# Altium project Robot.PrjPcb
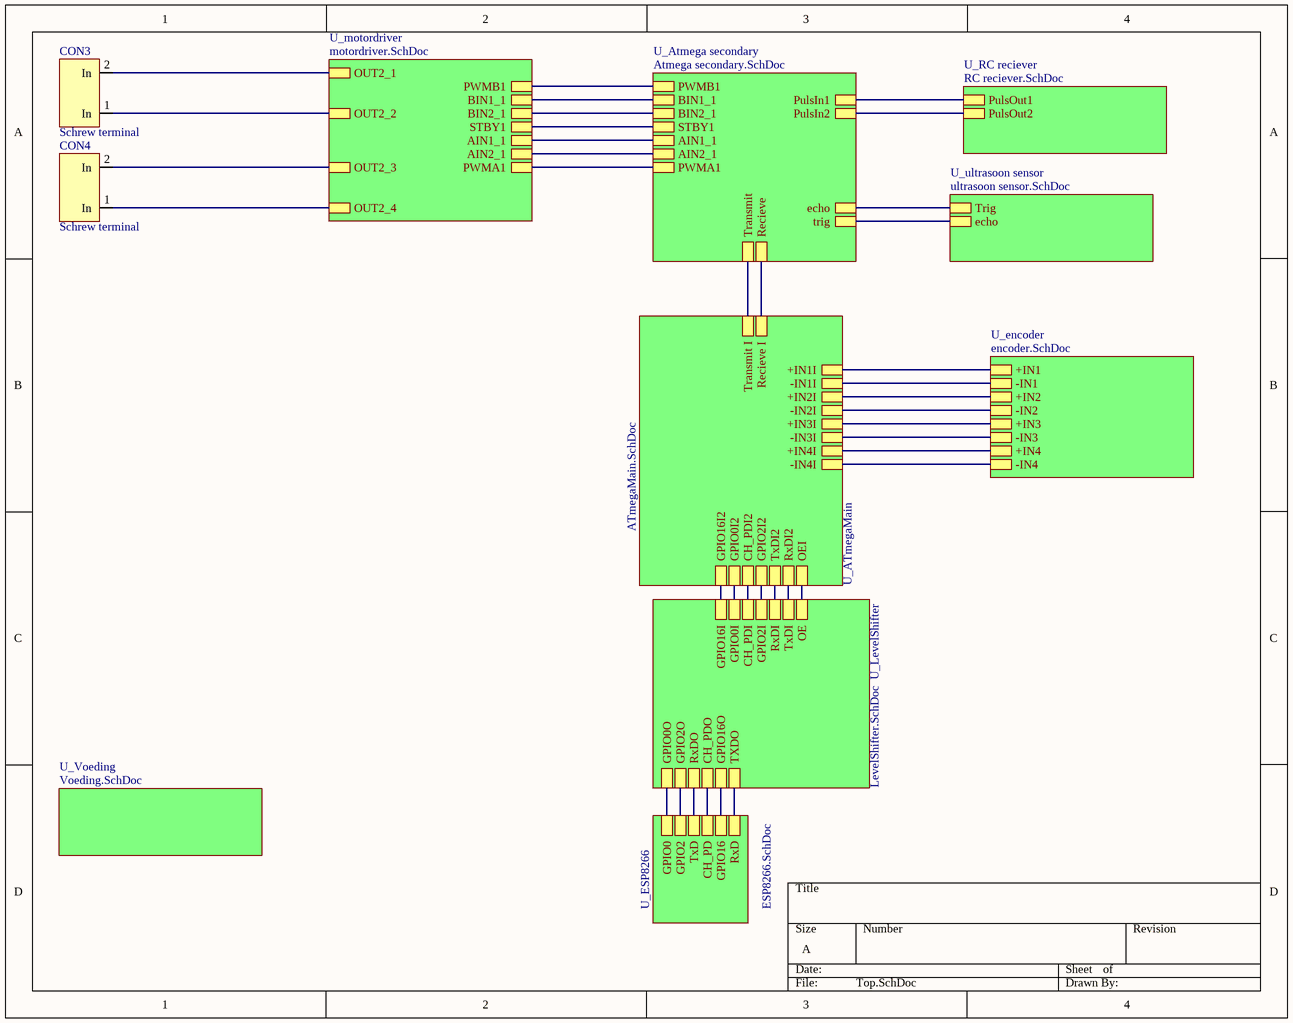
[diagram p0: Top.SchDoc]
11 sheets, 71 parts. Net scope: hierarchical (ports join the sheet entries above them; power ports are global).
Board file: ROBOTPCB.PcbDoc
Sheets:
  Top.SchDoc
    U_Voeding = Voeding.SchDoc
    U_ATmegaMain = ATmegaMain.SchDoc
    U_Atmega secondary = Atmega secondary.SchDoc
    U_encoder = encoder.SchDoc
    U_ESP8266 = ESP8266.SchDoc
    U_LevelShifter = LevelShifter.SchDoc
    U_motordriver = motordriver.SchDoc
    U_RC reciever = RC reciever.SchDoc
    U_ultrasoon sensor = ultrasoon sensor.SchDoc
  INA219 sensor.SchDoc

## Sheet Top.SchDoc
size A

### Parts
CON3  Schrew terminal  [ScrewTerminal]
CON4  Schrew terminal  [ScrewTerminal]

### Sub-sheets
U_Atmega secondary = Atmega secondary.SchDoc: PWMB1, BIN1_1, BIN2_1, STBY1, AIN1_1, AIN2_1, PWMA1, Transmit, Recieve, PulsIn1, PulsIn2, echo, trig
U_ATmegaMain = ATmegaMain.SchDoc: Recieve I, Transmit I, RxDI2, TxDI2, GPIO16I2, GPIO0I2, CH_PDI2, GPIO2I2, OEI, +IN1I, -IN1I, +IN2I, -IN2I, +IN3I, -IN3I, +IN4I, -IN4I
U_encoder = encoder.SchDoc: +IN1, -IN1, +IN2, -IN2, +IN3, -IN3, +IN4, -IN4
U_ESP8266 = ESP8266.SchDoc: RxD, GPIO16, CH_PD, TxD, GPIO2, GPIO0
U_LevelShifter = LevelShifter.SchDoc: RxDI, GPIO16I, GPIO0I, CH_PDI, GPIO2I, TxDI, RxDO, GPIO16O, GPIO0O, CH_PDO, GPIO2O, TXDO, OE
U_motordriver = motordriver.SchDoc: PWMA1, AIN2_1, AIN1_1, STBY1, BIN1_1, BIN2_1, PWMB1, OUT2_1, OUT2_2, OUT2_3, OUT2_4
U_RC reciever = RC reciever.SchDoc: PulsOut1, PulsOut2
U_ultrasoon sensor = ultrasoon sensor.SchDoc: Trig, echo
U_Voeding = Voeding.SchDoc: no entries

### Nets
NetCON3_1: CON3.1(In) ; sheet U_motordriver/OUT2_2
NetCON3_2: CON3.2(In) ; sheet U_motordriver/OUT2_1
NetCON4_1: CON4.1(In) ; sheet U_motordriver/OUT2_4
NetCON4_2: CON4.2(In) ; sheet U_motordriver/OUT2_3
NetCON5_2: sheet U_ATmegaMain/+IN1I, sheet U_encoder/+IN1
NetCON5_3: sheet U_ATmegaMain/-IN1I, sheet U_encoder/-IN1
NetCON6_2: sheet U_ATmegaMain/+IN2I, sheet U_encoder/+IN2
NetCON6_3: sheet U_ATmegaMain/-IN2I, sheet U_encoder/-IN2
NetCON7_2: sheet U_ATmegaMain/+IN3I, sheet U_encoder/+IN3
NetCON7_3: sheet U_ATmegaMain/-IN3I, sheet U_encoder/-IN3
NetCON8_2: sheet U_ATmegaMain/+IN4I, sheet U_encoder/+IN4
NetCON8_3: sheet U_ATmegaMain/-IN4I, sheet U_encoder/-IN4
NetCON11_1: sheet U_Atmega secondary/PulsIn1, sheet U_RC reciever/PulsOut1
NetCON12_1: sheet U_Atmega secondary/PulsIn2, sheet U_RC reciever/PulsOut2
NetIC1_1: sheet U_ESP8266/RxD, sheet U_LevelShifter/TXDO
NetIC1_3: sheet U_ESP8266/GPIO0, sheet U_LevelShifter/GPIO0O
NetIC1_4: sheet U_ESP8266/GPIO16, sheet U_LevelShifter/GPIO16O
NetIC1_5: sheet U_ESP8266/GPIO2, sheet U_LevelShifter/GPIO2O
NetIC1_6: sheet U_ESP8266/CH_PD, sheet U_LevelShifter/CH_PDO
NetIC1_8: sheet U_ESP8266/TxD, sheet U_LevelShifter/RxDO
NetU1_10: sheet U_ATmegaMain/OEI, sheet U_LevelShifter/OE
NetU1_13: sheet U_ATmegaMain/TxDI2, sheet U_LevelShifter/RxDI
NetU1_14: sheet U_ATmegaMain/GPIO16I2, sheet U_LevelShifter/GPIO16I
NetU1_15: sheet U_ATmegaMain/GPIO0I2, sheet U_LevelShifter/GPIO0I
NetU1_16: sheet U_ATmegaMain/CH_PDI2, sheet U_LevelShifter/CH_PDI
NetU1_17: sheet U_ATmegaMain/GPIO2I2, sheet U_LevelShifter/GPIO2I
NetU1_18: sheet U_ATmegaMain/RxDI2, sheet U_LevelShifter/TxDI
NetU2_8: sheet U_ATmegaMain/Recieve I, sheet U_Atmega secondary/Recieve
NetU2_9: sheet U_ATmegaMain/Transmit I, sheet U_Atmega secondary/Transmit
NetU5_8: sheet U_Atmega secondary/echo, sheet U_ultrasoon sensor/Trig
NetU5_9: sheet U_Atmega secondary/trig, sheet U_ultrasoon sensor/echo
NetU5_26: sheet U_Atmega secondary/PWMA1, sheet U_motordriver/PWMA1
NetU5_32: sheet U_Atmega secondary/AIN2_1, sheet U_motordriver/AIN2_1
NetU5_33: sheet U_Atmega secondary/AIN1_1, sheet U_motordriver/AIN1_1
NetU5_34: sheet U_Atmega secondary/STBY1, sheet U_motordriver/STBY1
NetU5_35: sheet U_Atmega secondary/BIN2_1, sheet U_motordriver/BIN2_1
NetU5_36: sheet U_Atmega secondary/BIN1_1, sheet U_motordriver/BIN1_1
NetU5_40: sheet U_Atmega secondary/PWMB1, sheet U_motordriver/PWMB1

## Sheet Voeding.SchDoc
size A
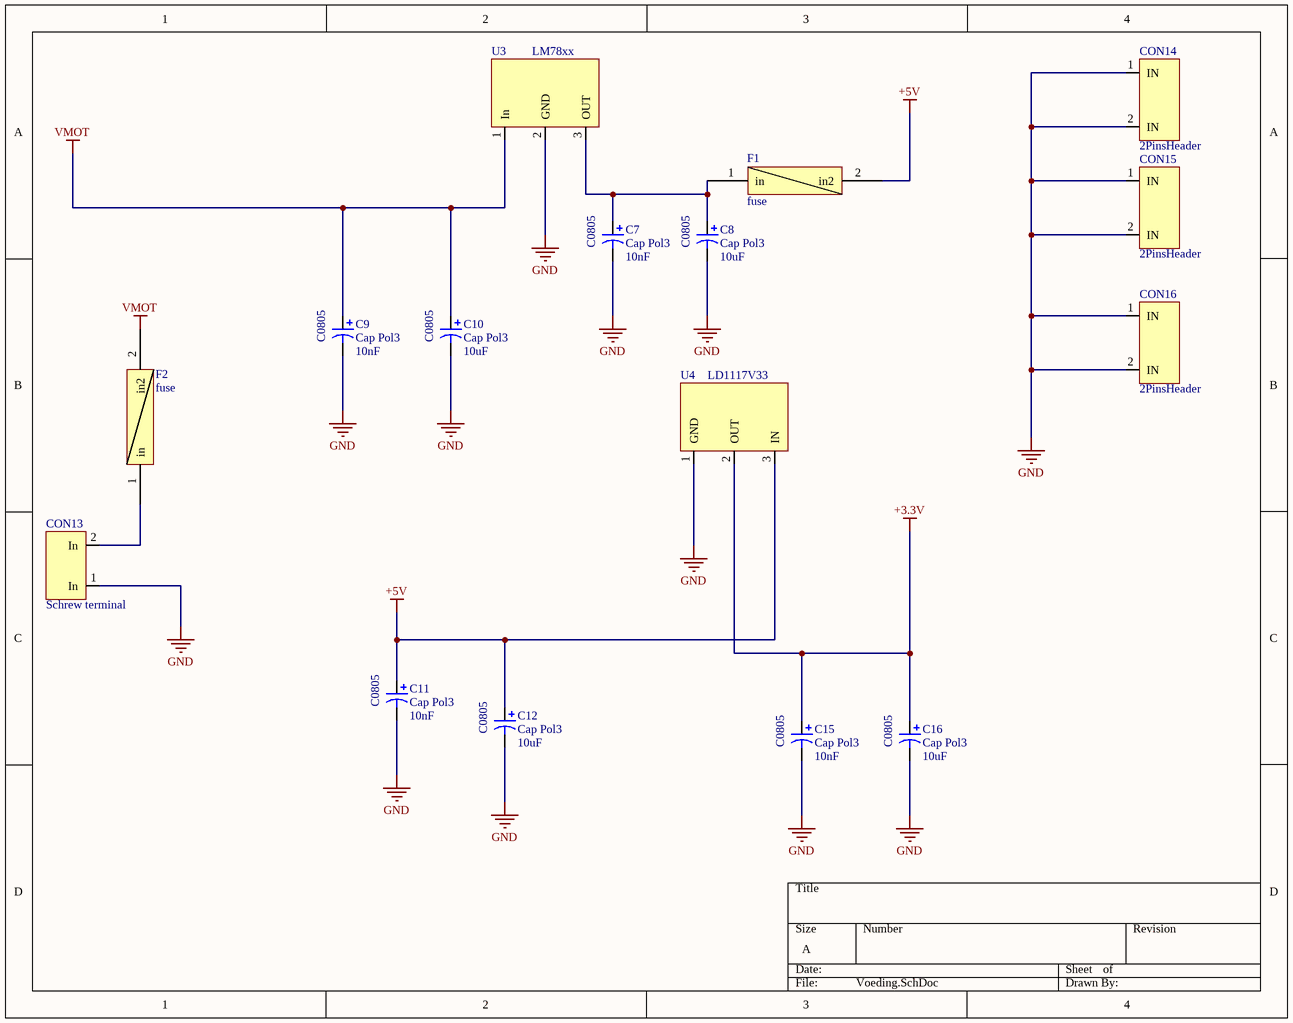
[diagram p1: Voeding.SchDoc]

### Parts
C7  Cap Pol3  value 10nF  [C0805]
C8  Cap Pol3  value 10uF  [C0805]
C9  Cap Pol3  value 10nF  [C0805]
C10  Cap Pol3  value 10uF  [C0805]
C11  Cap Pol3  value 10nF  [C0805]
C12  Cap Pol3  value 10uF  [C0805]
C15  Cap Pol3  value 10nF  [C0805]
C16  Cap Pol3  value 10uF  [C0805]
CON13  Schrew terminal  [ScrewTerminal]
CON14  2PinsHeader  [2PinsHeader]
CON15  2PinsHeader  [2PinsHeader]
CON16  2PinsHeader  [2PinsHeader]
F1  fuse  [Fuse]
F2  fuse  [Fuse]
U3  LM78xx  [LM78xx]
U4  LD1117V33  [LD117vxx]

### Nets
+3.3V: C15.1 C16.1 U4.2(OUT)
+5V: C11.1 C12.1 F1.2(in2) U4.3(IN)
GND: C7.2 C8.2 C9.2 C10.2 C11.2 C12.2 C15.2 C16.2 CON13.1(In) CON14.1(IN) CON14.2(IN) CON15.1(IN) CON15.2(IN) CON16.1(IN) CON16.2(IN) U3.2(GND) U4.1(GND)
VMOT: C9.1 C10.1 F2.2(in2) U3.1(In)
NetC7_1: C7.1 C8.1 F1.1(in) U3.3(OUT)
NetCON13_2: CON13.2(In) F2.1(in)

### Library data of the parts
C7-C12 C15 C16 = Cap Pol3: Polarized Capacitor (Surface Mount); Published: 8-Jun-2000; LatestRevisionDate: 29-May-2009; LatestRevisionNote: IPC-7351 Footprint Added.; PackageReference: C0805; Publisher: Altium Limited; PackageDescription: Chip Capacitor
F1 F2 = Component_1: fuse ptc

## Sheet ATmegaMain.SchDoc
size A
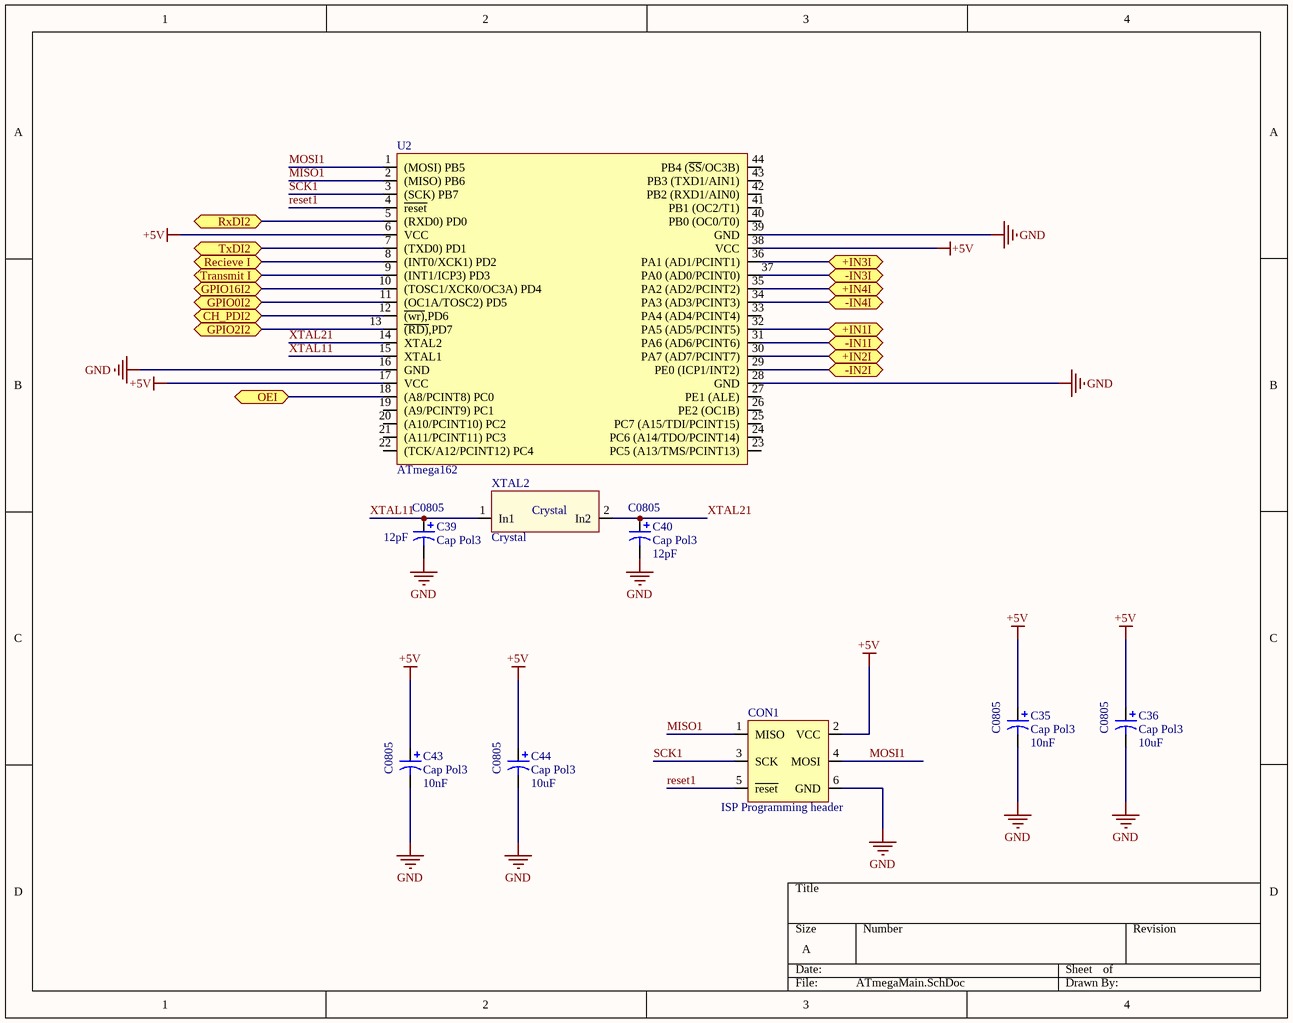
[diagram p2: ATmegaMain.SchDoc]

### Parts
C35  Cap Pol3  value 10nF  [C0805]
C36  Cap Pol3  value 10uF  [C0805]
C39  Cap Pol3  value 12pF  [C0805]
C40  Cap Pol3  value 12pF  [C0805]
C43  Cap Pol3  value 10nF  [C0805]
C44  Cap Pol3  value 10uF  [C0805]
CON1  ISP Programming header  [ISP programming header]
U2  ATmega162  [ATmga162]
XTAL2  Crystal  [Crystal]

### Ports
+IN1I, +IN2I, +IN3I, +IN4I, -IN1I, -IN2I, -IN3I, -IN4I, CH_PDI2, GPIO0I2, GPIO2I2, GPIO16I2, OEI, Recieve I, RxDI2, Transmit I, TxDI2

### Nets
+5V: C35.1 C36.1 C43.1 C44.1 CON1.2(VCC) U2.6(VCC) U2.17(VCC) U2.38(VCC)
GND: C35.2 C36.2 C39.2 C40.2 C43.2 C44.2 CON1.6(GND) U2.16(GND) U2.28(GND) U2.39(GND)
MISO1: CON1.1(MISO) U2.2((MISO)_PB6)
MOSI1: CON1.4(MOSI) U2.1((MOSI)_PB5)
reset1: CON1.5(~{reset}) U2.4(~{reset})
SCK1: CON1.3(SCK) U2.3((SCK)_PB7)
XTAL11: C39.1 U2.15(XTAL1) XTAL2.1(In1)
XTAL21: C40.1 U2.14(XTAL2) XTAL2.2(In2)
NetCON5_2: U2.32(PA5_(AD5/PCINT5)) ; port +IN1I
NetCON5_3: U2.31(PA6_(AD6/PCINT6)) ; port -IN1I
NetCON6_2: U2.30(PA7_(AD7/PCINT7)) ; port +IN2I
NetCON6_3: U2.29(PE0_(ICP1/INT2)) ; port -IN2I
NetCON7_2: U2.36(PA1_(AD1/PCINT1)) ; port +IN3I
NetCON7_3: U2.37(PA0_(AD0/PCINT0)) ; port -IN3I
NetCON8_2: U2.35(PA2_(AD2/PCINT2)) ; port +IN4I
NetCON8_3: U2.34(PA3_(AD3/PCINT3)) ; port -IN4I
NetU1_10: U2.18((A8/PCINT8)_PC0) ; port OEI
NetU1_13: U2.7((TXD0)_PD1) ; port TxDI2
NetU1_14: U2.10((TOSC1/XCK0/OC3A)_PD4) ; port GPIO16I2
NetU1_15: U2.11((OC1A/TOSC2)_PD5) ; port GPIO0I2
NetU1_16: U2.12(~{(wr}~{)},PD6) ; port CH_PDI2
NetU1_17: U2.13(~{(RD)},PD7) ; port GPIO2I2
NetU1_18: U2.5((RXD0)_PD0) ; port RxDI2
NetU2_8: U2.8((INT0/XCK1)_PD2) ; port Recieve I
NetU2_9: U2.9((INT1/ICP3)_PD3) ; port Transmit I

Not connected (* = marked no-connect by the designer): U2 19((A9/PCINT9)_PC1) 20((A10/PCINT10)_PC2) 21((A11/PCINT11)_PC3) 22((TCK/A12/PCINT12)_PC4) 23(PC5_(A13/TMS/PCINT13)) 24(PC6_(A14/TDO/PCINT14)) 25(PC7_(A15/TDI/PCINT15)) 26(PE2_(OC1B)) 27(PE1_(ALE)) 33(PA4_(AD4/PCINT4)) 40(PB0_(OC0/T0)) 41(PB1_(OC2/T1)) 42(PB2_(RXD1/AIN0)) 43(PB3_(TXD1/AIN1)) 44(PB4_(~{SS}/OC3B))

### Library data of the parts
C35 C36 C39 C40 C43 C44 = Cap Pol3: Polarized Capacitor (Surface Mount); Published: 8-Jun-2000; LatestRevisionDate: 29-May-2009; LatestRevisionNote: IPC-7351 Footprint Added.; PackageReference: C0805; Publisher: Altium Limited; PackageDescription: Chip Capacitor

## Sheet Atmega secondary.SchDoc
size A
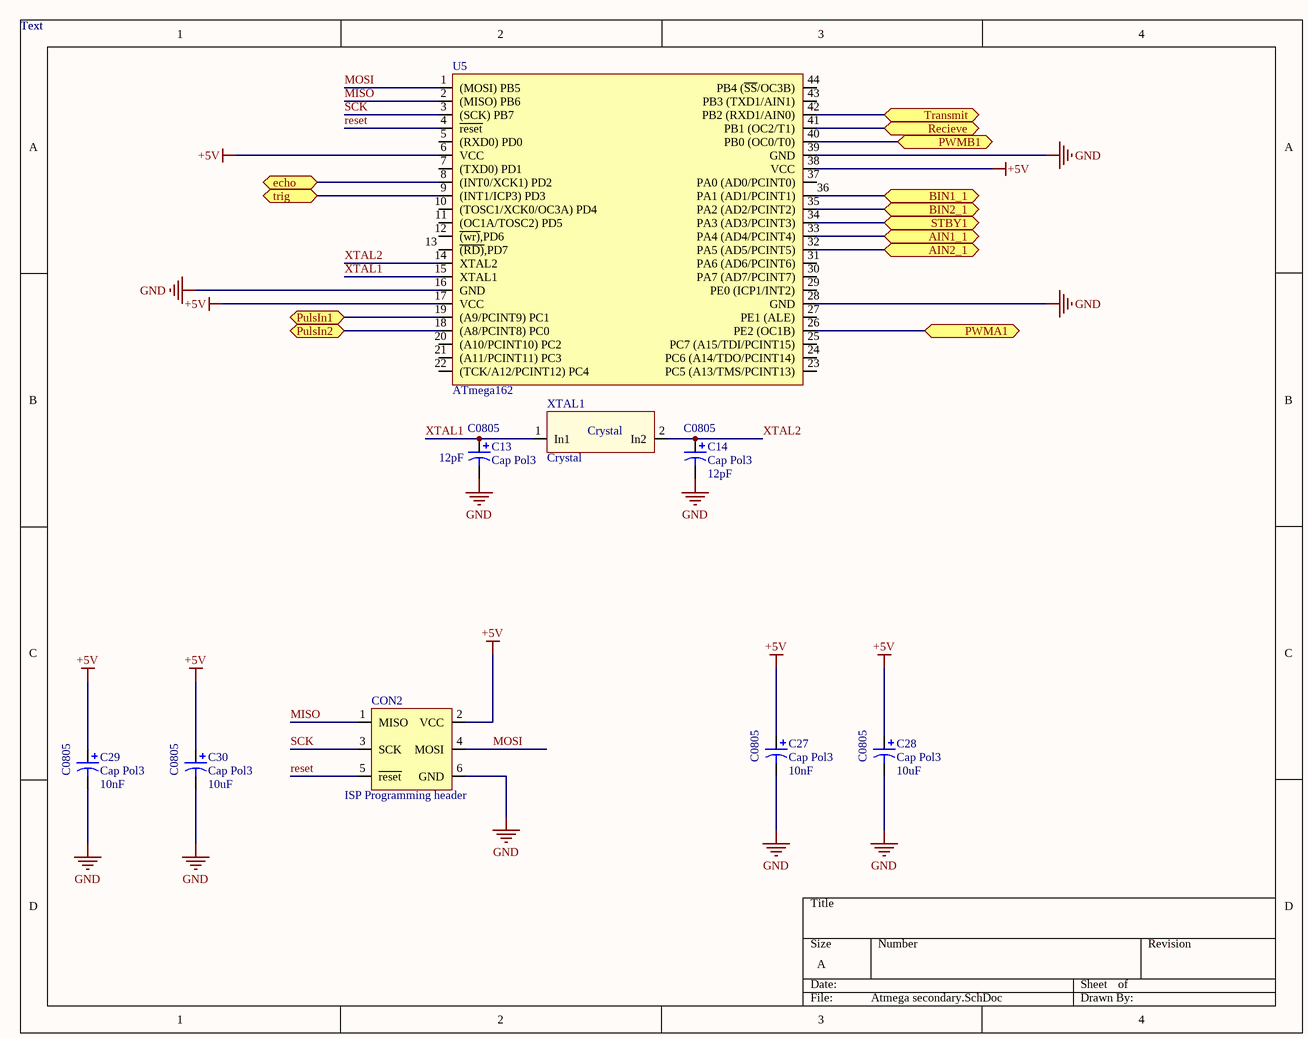
[diagram p3: Atmega secondary.SchDoc]

### Parts
C13  Cap Pol3  value 12pF  [C0805]
C14  Cap Pol3  value 12pF  [C0805]
C27  Cap Pol3  value 10nF  [C0805]
C28  Cap Pol3  value 10uF  [C0805]
C29  Cap Pol3  value 10nF  [C0805]
C30  Cap Pol3  value 10uF  [C0805]
CON2  ISP Programming header  [ISP programming header]
U5  ATmega162  [ATmga162]
XTAL1  Crystal  [Crystal]

### Ports
AIN1_1, AIN2_1, BIN1_1, BIN2_1, echo, PulsIn1, PulsIn2, PWMA1, PWMB1, Recieve, STBY1, Transmit, trig

### Nets
+5V: C27.1 C28.1 C29.1 C30.1 CON2.2(VCC) U5.6(VCC) U5.17(VCC) U5.38(VCC)
GND: C13.2 C14.2 C27.2 C28.2 C29.2 C30.2 CON2.6(GND) U5.16(GND) U5.28(GND) U5.39(GND)
MISO: CON2.1(MISO) U5.2((MISO)_PB6)
MOSI: CON2.4(MOSI) U5.1((MOSI)_PB5)
reset: CON2.5(~{reset}) U5.4(~{reset})
SCK: CON2.3(SCK) U5.3((SCK)_PB7)
XTAL1: C13.1 U5.15(XTAL1) XTAL1.1(In1)
XTAL2: C14.1 U5.14(XTAL2) XTAL1.2(In2)
NetCON11_1: U5.19((A9/PCINT9)_PC1) ; port PulsIn1
NetCON12_1: U5.18((A8/PCINT8)_PC0) ; port PulsIn2
NetU2_8: U5.41(PB1_(OC2/T1)) ; port Recieve
NetU2_9: U5.42(PB2_(RXD1/AIN0)) ; port Transmit
NetU5_8: U5.8((INT0/XCK1)_PD2) ; port echo
NetU5_9: U5.9((INT1/ICP3)_PD3) ; port trig
NetU5_26: U5.26(PE2_(OC1B)) ; port PWMA1
NetU5_32: U5.32(PA5_(AD5/PCINT5)) ; port AIN2_1
NetU5_33: U5.33(PA4_(AD4/PCINT4)) ; port AIN1_1
NetU5_34: U5.34(PA3_(AD3/PCINT3)) ; port STBY1
NetU5_35: U5.35(PA2_(AD2/PCINT2)) ; port BIN2_1
NetU5_36: U5.36(PA1_(AD1/PCINT1)) ; port BIN1_1
NetU5_40: U5.40(PB0_(OC0/T0)) ; port PWMB1

Not connected (* = marked no-connect by the designer): U5 5((RXD0)_PD0) 7((TXD0)_PD1) 10((TOSC1/XCK0/OC3A)_PD4) 11((OC1A/TOSC2)_PD5) 12(~{(wr}~{)},PD6) 13(~{(RD)},PD7) 20((A10/PCINT10)_PC2) 21((A11/PCINT11)_PC3) 22((TCK/A12/PCINT12)_PC4) 23(PC5_(A13/TMS/PCINT13)) 24(PC6_(A14/TDO/PCINT14)) 25(PC7_(A15/TDI/PCINT15)) 27(PE1_(ALE)) 29(PE0_(ICP1/INT2)) 30(PA7_(AD7/PCINT7)) 31(PA6_(AD6/PCINT6)) 37(PA0_(AD0/PCINT0)) 43(PB3_(TXD1/AIN1)) 44(PB4_(~{SS}/OC3B))

### Notes on the sheet
- Text

### Library data of the parts
C13 C14 C27-C30 = Cap Pol3: Polarized Capacitor (Surface Mount); Published: 8-Jun-2000; LatestRevisionDate: 29-May-2009; LatestRevisionNote: IPC-7351 Footprint Added.; PackageReference: C0805; Publisher: Altium Limited; PackageDescription: Chip Capacitor

## Sheet encoder.SchDoc
size A
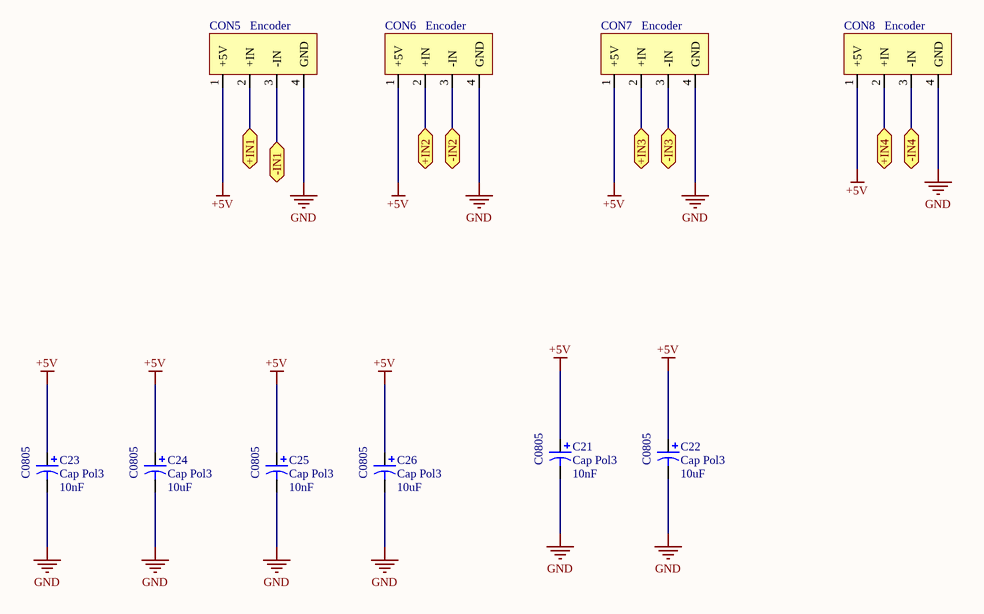
[diagram p4: encoder.SchDoc]

### Parts
C21  Cap Pol3  value 10nF  [C0805]
C22  Cap Pol3  value 10uF  [C0805]
C23  Cap Pol3  value 10nF  [C0805]
C24  Cap Pol3  value 10uF  [C0805]
C25  Cap Pol3  value 10nF  [C0805]
C26  Cap Pol3  value 10uF  [C0805]
CON5  Encoder  [ENCODER]
CON6  Encoder  [ENCODER]
CON7  Encoder  [ENCODER]
CON8  Encoder  [ENCODER]

### Ports
+IN1, +IN2, +IN3, +IN4, -IN1, -IN2, -IN3, -IN4

### Nets
+5V: C21.1 C22.1 C23.1 C24.1 C25.1 C26.1 CON5.1(+5V) CON6.1(+5V) CON7.1(+5V) CON8.1(+5V)
GND: C21.2 C22.2 C23.2 C24.2 C25.2 C26.2 CON5.4(GND) CON6.4(GND) CON7.4(GND) CON8.4(GND)
NetCON5_2: CON5.2(+IN) ; port +IN1
NetCON5_3: CON5.3(-IN) ; port -IN1
NetCON6_2: CON6.2(+IN) ; port +IN2
NetCON6_3: CON6.3(-IN) ; port -IN2
NetCON7_2: CON7.2(+IN) ; port +IN3
NetCON7_3: CON7.3(-IN) ; port -IN3
NetCON8_2: CON8.2(+IN) ; port +IN4
NetCON8_3: CON8.3(-IN) ; port -IN4

### Library data of the parts
C21-C26 = Cap Pol3: Polarized Capacitor (Surface Mount); Published: 8-Jun-2000; LatestRevisionDate: 29-May-2009; LatestRevisionNote: IPC-7351 Footprint Added.; PackageReference: C0805; Publisher: Altium Limited; PackageDescription: Chip Capacitor

## Sheet ESP8266.SchDoc
size A
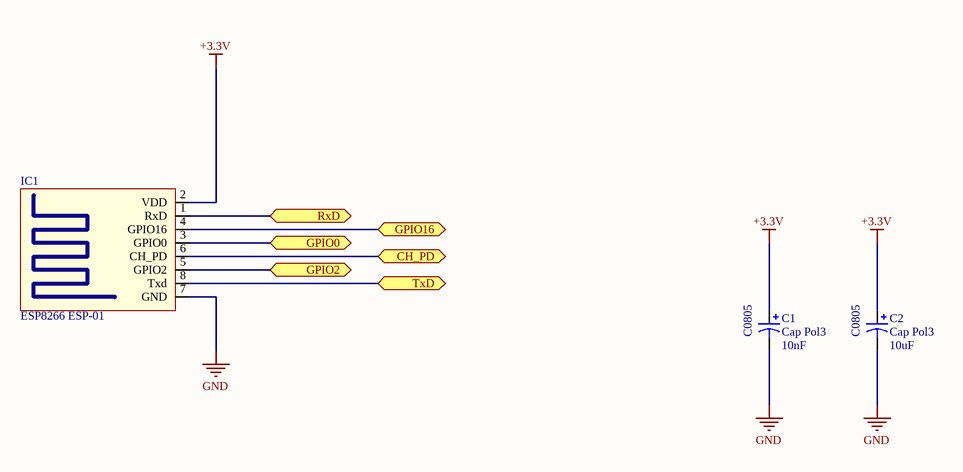
[diagram p5: ESP8266.SchDoc]

### Parts
C1  Cap Pol3  value 10nF  [C0805]
C2  Cap Pol3  value 10uF  [C0805]
IC1  ESP8266 ESP-01  [ESP8266 ESP-01]

### Ports
CH_PD, GPIO0, GPIO2, GPIO16, RxD, TxD

### Nets
+3.3V: C1.1 C2.1 IC1.2(VDD)
GND: C1.2 C2.2 IC1.7(GND)
NetIC1_1: IC1.1(RxD) ; port RxD
NetIC1_3: IC1.3(GPIO0) ; port GPIO0
NetIC1_4: IC1.4(GPIO16) ; port GPIO16
NetIC1_5: IC1.5(GPIO2) ; port GPIO2
NetIC1_6: IC1.6(CH_PD) ; port CH_PD
NetIC1_8: IC1.8(Txd) ; port TxD

### Library data of the parts
C1 C2 = Cap Pol3: Polarized Capacitor (Surface Mount); Published: 8-Jun-2000; LatestRevisionDate: 29-May-2009; LatestRevisionNote: IPC-7351 Footprint Added.; PackageReference: C0805; Publisher: Altium Limited; PackageDescription: Chip Capacitor

## Sheet LevelShifter.SchDoc
size A
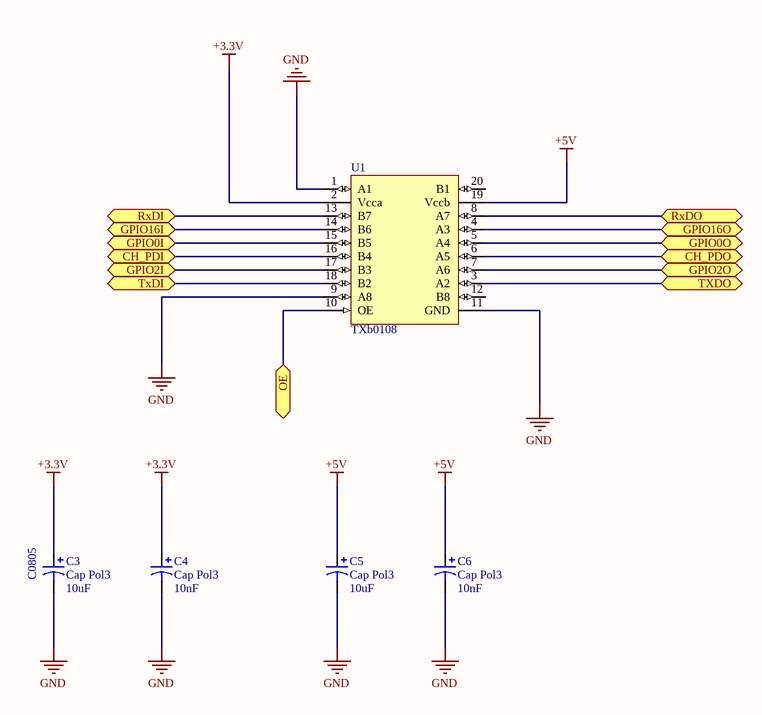
[diagram p6: LevelShifter.SchDoc]

### Parts
C3  Cap Pol3  value 10uF  [C0805]
C4  Cap Pol3  value 10nF  [C0805]
C5  Cap Pol3  value 10uF  [C0805]
C6  Cap Pol3  value 10nF  [C0805]
U1  TXb0108  [TXB0108]

### Ports
CH_PDI, CH_PDO, GPIO0I, GPIO0O, GPIO2I, GPIO2O, GPIO16I, GPIO16O, OE, RxDI, RxDO, TxDI, TXDO

### Nets
+3.3V: C3.1 C4.1 U1.2(Vcca)
+5V: C5.1 C6.1 U1.19(Vccb)
GND: C3.2 C4.2 C5.2 C6.2 U1.1(A1) U1.9(A8) U1.11(GND)
NetIC1_1: U1.3(A2) ; port TXDO
NetIC1_3: U1.5(A4) ; port GPIO0O
NetIC1_4: U1.4(A3) ; port GPIO16O
NetIC1_5: U1.7(A6) ; port GPIO2O
NetIC1_6: U1.6(A5) ; port CH_PDO
NetIC1_8: U1.8(A7) ; port RxDO
NetU1_10: U1.10(OE) ; port OE
NetU1_13: U1.13(B7) ; port RxDI
NetU1_14: U1.14(B6) ; port GPIO16I
NetU1_15: U1.15(B5) ; port GPIO0I
NetU1_16: U1.16(B4) ; port CH_PDI
NetU1_17: U1.17(B3) ; port GPIO2I
NetU1_18: U1.18(B2) ; port TxDI

Not connected (* = marked no-connect by the designer): U1 12(B8) 20(B1)

### Library data of the parts
C3-C6 = Cap Pol3: Polarized Capacitor (Surface Mount); Published: 8-Jun-2000; LatestRevisionDate: 29-May-2009; LatestRevisionNote: IPC-7351 Footprint Added.; PackageReference: C0805; Publisher: Altium Limited; PackageDescription: Chip Capacitor

## Sheet motordriver.SchDoc
size A
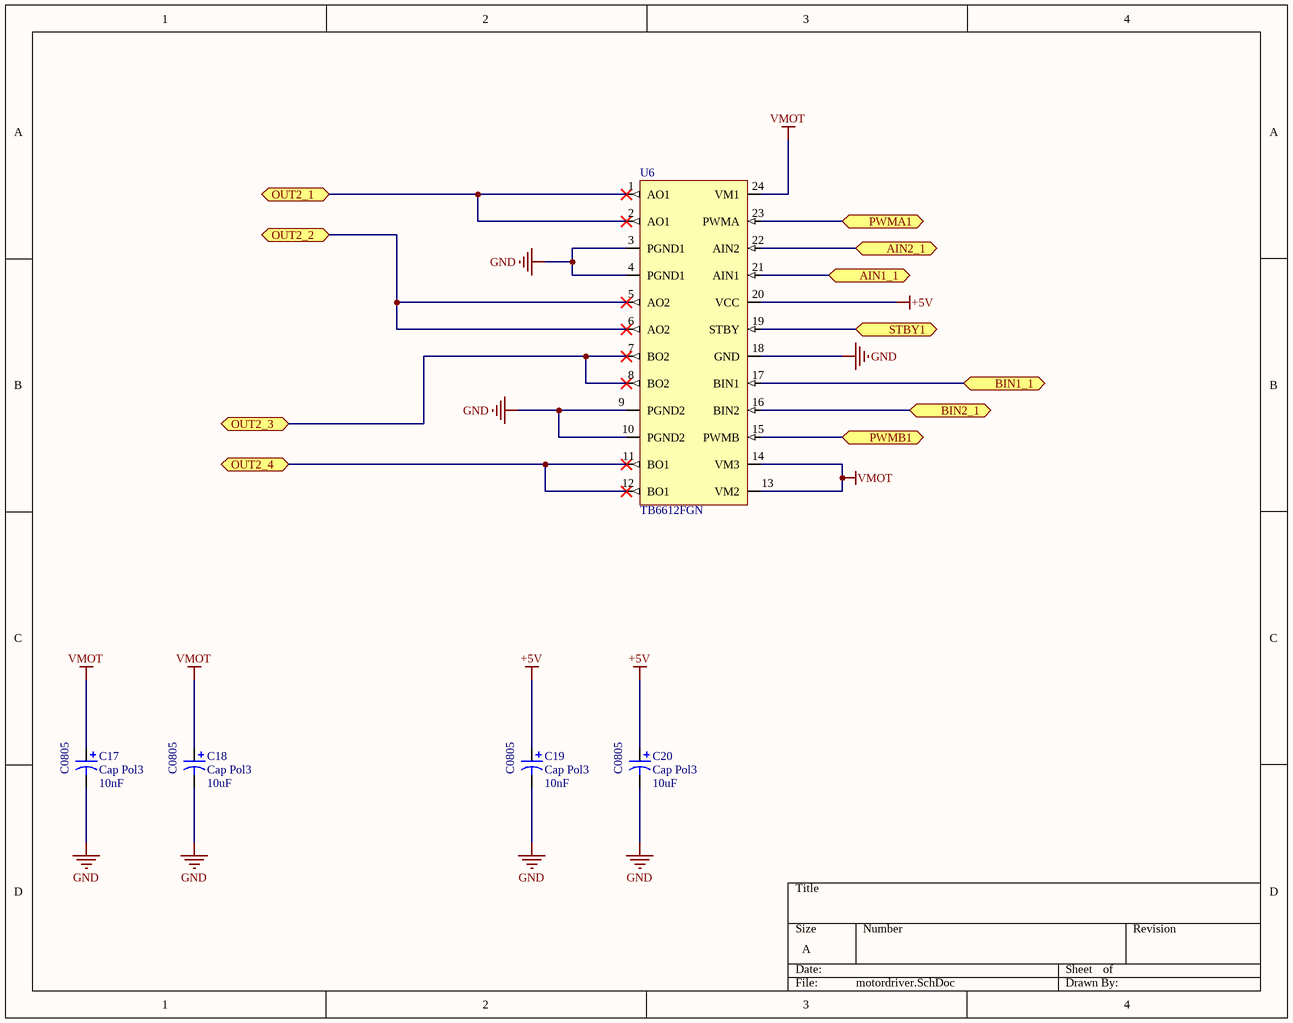
[diagram p7: motordriver.SchDoc]

### Parts
C17  Cap Pol3  value 10nF  [C0805]
C18  Cap Pol3  value 10uF  [C0805]
C19  Cap Pol3  value 10nF  [C0805]
C20  Cap Pol3  value 10uF  [C0805]
U6  TB6612FGN  [TBS6612FNG]

### Ports
AIN1_1, AIN2_1, BIN1_1, BIN2_1, OUT2_1, OUT2_2, OUT2_3, OUT2_4, PWMA1, PWMB1, STBY1

### Nets
+5V: C19.1 C20.1 U6.20(VCC)
GND: C17.2 C18.2 C19.2 C20.2 U6.3(PGND1) U6.4(PGND1) U6.9(PGND2) U6.10(PGND2) U6.18(GND)
VMOT: C17.1 C18.1 U6.13(VM2) U6.14(VM3) U6.24(VM1)
NetCON3_1: U6.5(AO2) U6.6(AO2) ; port OUT2_2
NetCON3_2: U6.1(AO1) U6.2(AO1) ; port OUT2_1
NetCON4_1: U6.11(BO1) U6.12(BO1) ; port OUT2_4
NetCON4_2: U6.7(BO2) U6.8(BO2) ; port OUT2_3
NetU5_26: U6.23(PWMA) ; port PWMA1
NetU5_32: U6.22(AIN2) ; port AIN2_1
NetU5_33: U6.21(AIN1) ; port AIN1_1
NetU5_34: U6.19(STBY) ; port STBY1
NetU5_35: U6.16(BIN2) ; port BIN2_1
NetU5_36: U6.17(BIN1) ; port BIN1_1
NetU5_40: U6.15(PWMB) ; port PWMB1

### Library data of the parts
C17-C20 = Cap Pol3: Polarized Capacitor (Surface Mount); Published: 8-Jun-2000; LatestRevisionDate: 29-May-2009; LatestRevisionNote: IPC-7351 Footprint Added.; PackageReference: C0805; Publisher: Altium Limited; PackageDescription: Chip Capacitor

## Sheet RC reciever.SchDoc
size A
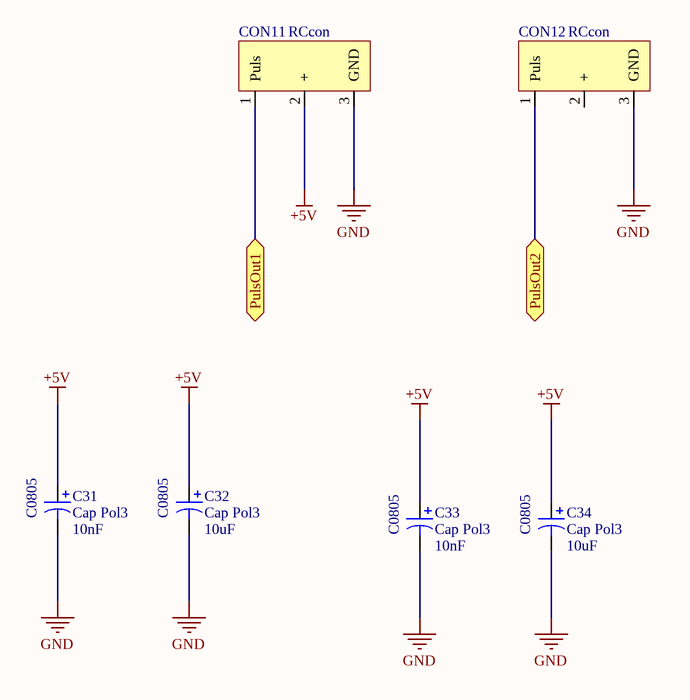
[diagram p8: RC reciever.SchDoc]

### Parts
C31  Cap Pol3  value 10nF  [C0805]
C32  Cap Pol3  value 10uF  [C0805]
C33  Cap Pol3  value 10nF  [C0805]
C34  Cap Pol3  value 10uF  [C0805]
CON11  RCcon  [RcCon]
CON12  RCcon  [RcCon]

### Ports
PulsOut1, PulsOut2

### Nets
+5V: C31.1 C32.1 C33.1 C34.1 CON11.2(+)
GND: C31.2 C32.2 C33.2 C34.2 CON11.3(GND) CON12.3(GND)
NetCON11_1: CON11.1(Puls) ; port PulsOut1
NetCON12_1: CON12.1(Puls) ; port PulsOut2

Not connected (* = marked no-connect by the designer): CON12 2(+)

### Library data of the parts
C31-C34 = Cap Pol3: Polarized Capacitor (Surface Mount); Published: 8-Jun-2000; LatestRevisionDate: 29-May-2009; LatestRevisionNote: IPC-7351 Footprint Added.; PackageReference: C0805; Publisher: Altium Limited; PackageDescription: Chip Capacitor
CON11 CON12 = Rc con

## Sheet ultrasoon sensor.SchDoc
size A
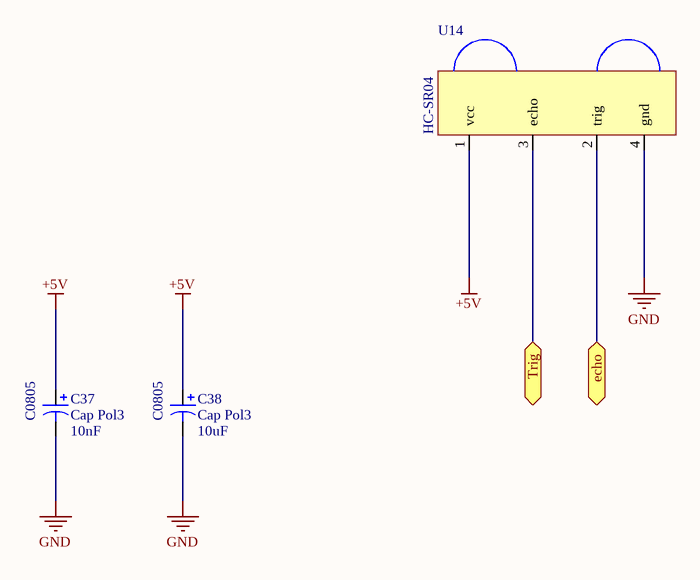
[diagram p9: ultrasoon sensor.SchDoc]

### Parts
C37  Cap Pol3  value 10nF  [C0805]
C38  Cap Pol3  value 10uF  [C0805]
U14  HC-SR04  [ultrasoonSensor]

### Ports
echo, Trig

### Nets
+5V: C37.1 C38.1 U14.1(vcc)
GND: C37.2 C38.2 U14.4(gnd)
NetU5_8: U14.3(echo) ; port Trig
NetU5_9: U14.2(trig) ; port echo

### Library data of the parts
C37 C38 = Cap Pol3: Polarized Capacitor (Surface Mount); Published: 8-Jun-2000; LatestRevisionDate: 29-May-2009; LatestRevisionNote: IPC-7351 Footprint Added.; PackageReference: C0805; Publisher: Altium Limited; PackageDescription: Chip Capacitor

## Sheet INA219 sensor.SchDoc
size A
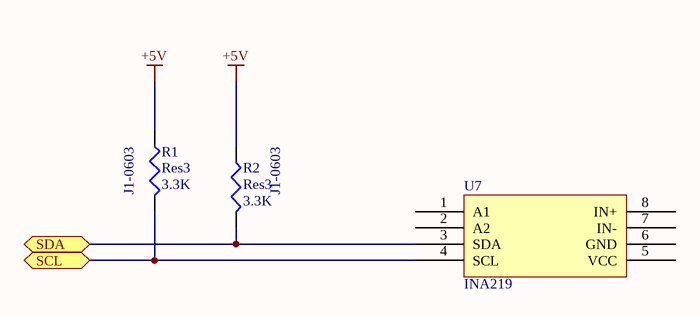
[diagram p10: INA219 sensor.SchDoc]

### Parts
R1  Res3  value 3.3K  [J1-0603]
R2  Res3  value 3.3K  [J1-0603]
U7  INA219  [INA219]

### Ports
SCL, SDA

### Nets
+5V: R1.1 R2.1
NetR1_2: R1.2 U7.4(SCL) ; port SCL
NetR2_2: R2.2 U7.3(SDA) ; port SDA

Not connected (* = marked no-connect by the designer): U7 1(A1) 2(A2) 5(VCC) 6(GND) 7(IN-) 8(IN+)

### Library data of the parts
R1 R2 = Res3: Resistor; Published: 8-Jun-2000; LatestRevisionDate: 29-May-2009; LatestRevisionNote: IPC-7351 Footprint Added.; PackageReference: J1-0603; Publisher: Altium Limited; PackageDescription: Chip Resistor

## Nets that join several sheets
+3.3V: Voeding (C15.1 C16.1 U4.2), ESP8266 (C1.1 C2.1 IC1.2), LevelShifter (C3.1 C4.1 U1.2)
+5V: Voeding (C11.1 C12.1 F1.2 U4.3), ATmegaMain (8 pins), Atmega secondary (8 pins), encoder (10 pins), LevelShifter (C5.1 C6.1 U1.19), motordriver (C19.1 C20.1 U6.20), RC reciever (5 pins), ultrasoon sensor (C37.1 C38.1 U14.1), INA219 sensor (R1.1 R2.1)
GND: Voeding (17 pins), ATmegaMain (10 pins), Atmega secondary (10 pins), encoder (10 pins), ESP8266 (C1.2 C2.2 IC1.7), LevelShifter (7 pins), motordriver (9 pins), RC reciever (6 pins), ultrasoon sensor (C37.2 C38.2 U14.4)
VMOT: Voeding (C9.1 C10.1 F2.2 U3.1), motordriver (5 pins)
NetCON3_1: Top (CON3.1), motordriver (U6.5 U6.6)
NetCON3_2: Top (CON3.2), motordriver (U6.1 U6.2)
NetCON4_1: Top (CON4.1), motordriver (U6.11 U6.12)
NetCON4_2: Top (CON4.2), motordriver (U6.7 U6.8)
NetCON5_2: ATmegaMain (U2.32), encoder (CON5.2)
NetCON5_3: ATmegaMain (U2.31), encoder (CON5.3)
NetCON6_2: ATmegaMain (U2.30), encoder (CON6.2)
NetCON6_3: ATmegaMain (U2.29), encoder (CON6.3)
NetCON7_2: ATmegaMain (U2.36), encoder (CON7.2)
NetCON7_3: ATmegaMain (U2.37), encoder (CON7.3)
NetCON8_2: ATmegaMain (U2.35), encoder (CON8.2)
NetCON8_3: ATmegaMain (U2.34), encoder (CON8.3)
NetCON11_1: Atmega secondary (U5.19), RC reciever (CON11.1)
NetCON12_1: Atmega secondary (U5.18), RC reciever (CON12.1)
NetIC1_1: ESP8266 (IC1.1), LevelShifter (U1.3)
NetIC1_3: ESP8266 (IC1.3), LevelShifter (U1.5)
NetIC1_4: ESP8266 (IC1.4), LevelShifter (U1.4)
NetIC1_5: ESP8266 (IC1.5), LevelShifter (U1.7)
NetIC1_6: ESP8266 (IC1.6), LevelShifter (U1.6)
NetIC1_8: ESP8266 (IC1.8), LevelShifter (U1.8)
NetU1_10: ATmegaMain (U2.18), LevelShifter (U1.10)
NetU1_13: ATmegaMain (U2.7), LevelShifter (U1.13)
NetU1_14: ATmegaMain (U2.10), LevelShifter (U1.14)
NetU1_15: ATmegaMain (U2.11), LevelShifter (U1.15)
NetU1_16: ATmegaMain (U2.12), LevelShifter (U1.16)
NetU1_17: ATmegaMain (U2.13), LevelShifter (U1.17)
NetU1_18: ATmegaMain (U2.5), LevelShifter (U1.18)
NetU2_8: ATmegaMain (U2.8), Atmega secondary (U5.41)
NetU2_9: ATmegaMain (U2.9), Atmega secondary (U5.42)
NetU5_8: Atmega secondary (U5.8), ultrasoon sensor (U14.3)
NetU5_9: Atmega secondary (U5.9), ultrasoon sensor (U14.2)
NetU5_26: Atmega secondary (U5.26), motordriver (U6.23)
NetU5_32: Atmega secondary (U5.32), motordriver (U6.22)
NetU5_33: Atmega secondary (U5.33), motordriver (U6.21)
NetU5_34: Atmega secondary (U5.34), motordriver (U6.19)
NetU5_35: Atmega secondary (U5.35), motordriver (U6.16)
NetU5_36: Atmega secondary (U5.36), motordriver (U6.17)
NetU5_40: Atmega secondary (U5.40), motordriver (U6.15)